# EAGLE design Grove - Sound Sensor v1.6 (EAGLE 6.4)

## Sheet 1 of 2
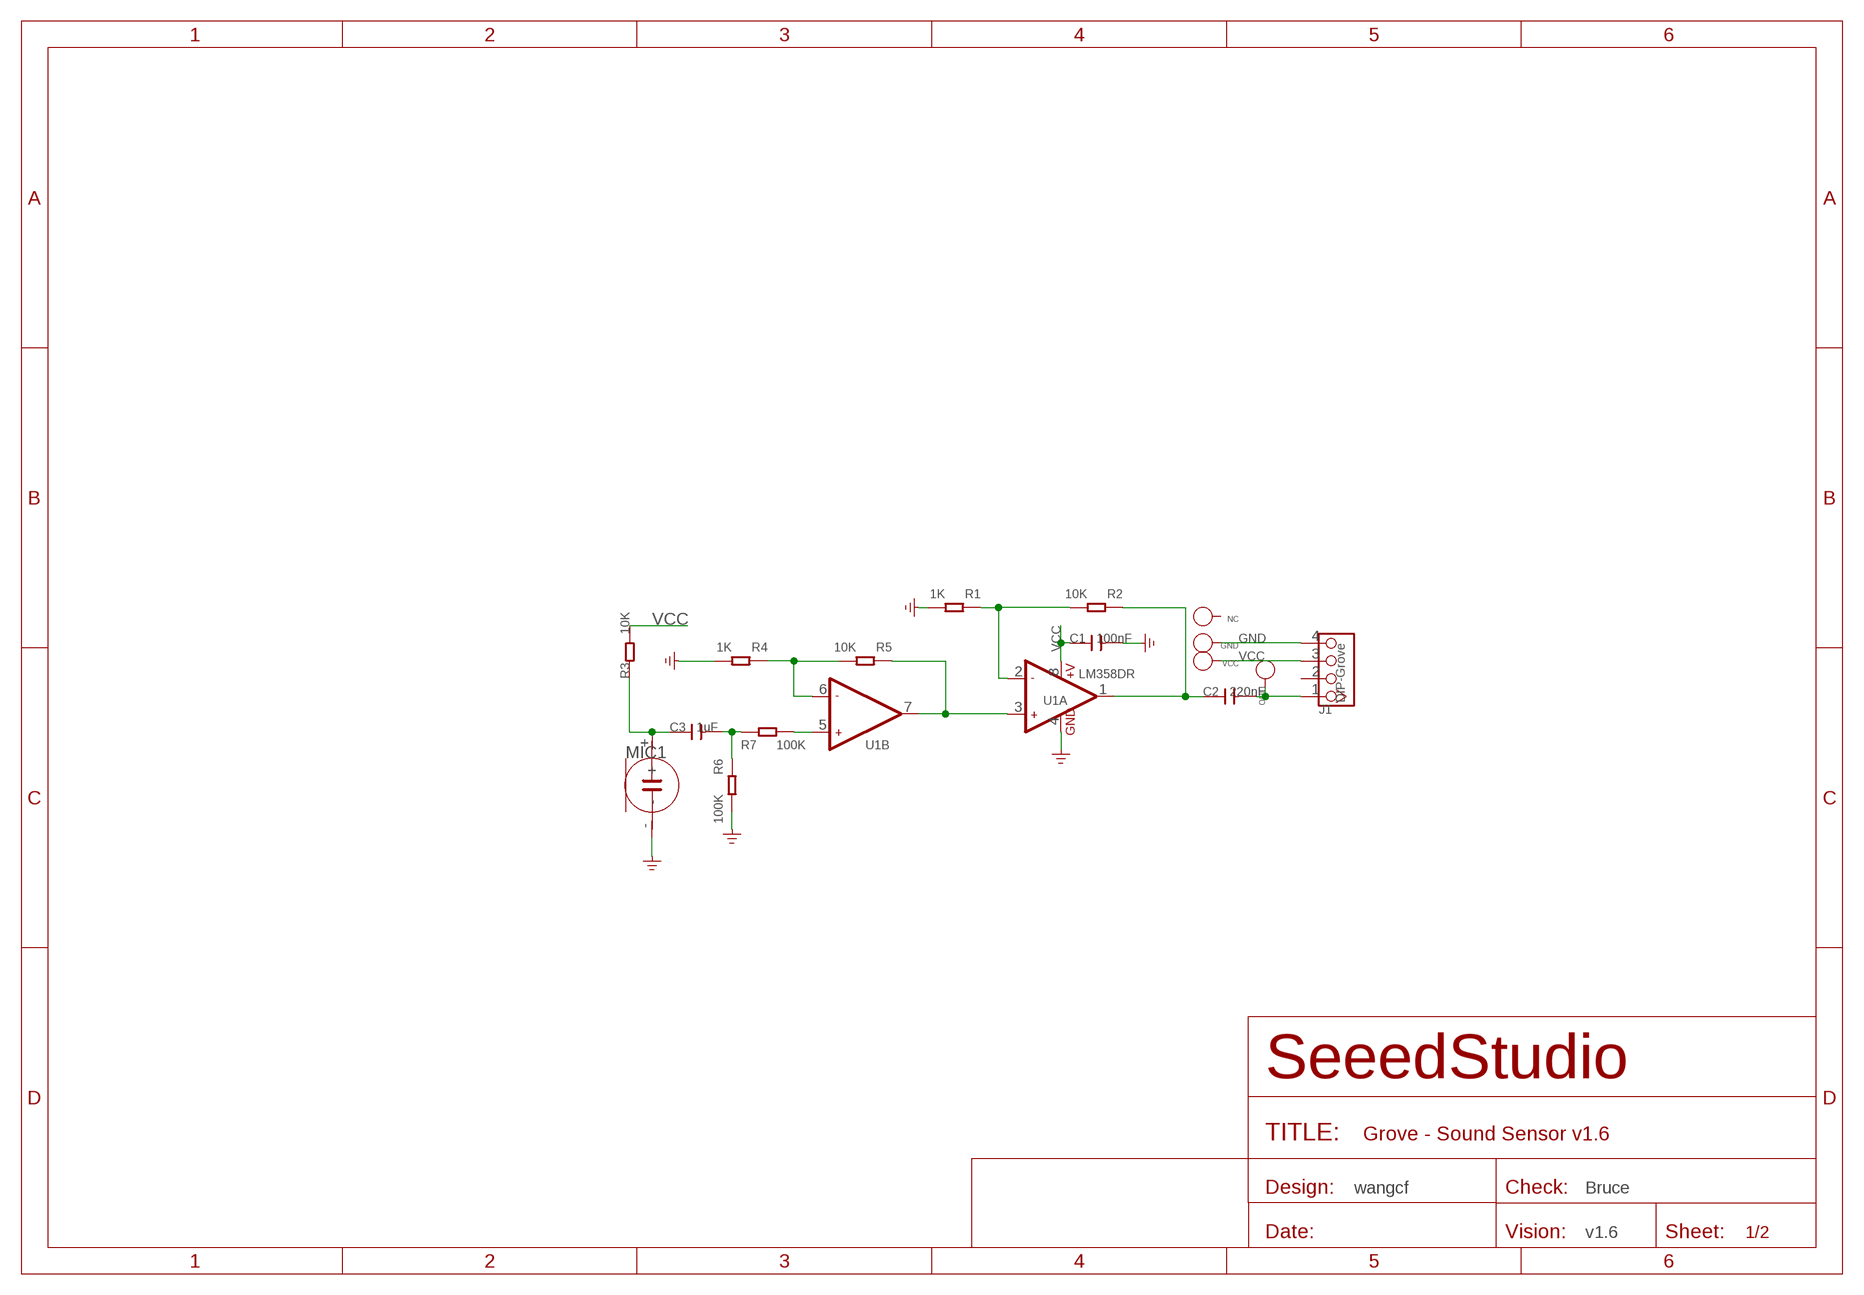
[diagram p0: schematic, sheet 1]

### Parts
C1  100nF  C-0603  [C0603]
C2  220nF  C-0603  [C0603]
C3  1uF  C-0603  [C0603]
GND  PAD-TEST-POINT'4545'  [TP_4545]
J1  DIP-Grove  TWIG-4P-2.0-2.0  [4P-2.0]
MIC1  MICROPHONE'KS-9745P,-56DB'  [2P-D9.7/4.5H]
NC  PAD-TEST-POINT'4545'  [TP_4545]
OUT  PAD-TEST-POINT'4545'  [TP_4545]
R1  1K  R-0603  [R0603]
R2  10K  R-0603  [R0603]
R3  10K  R-0603  [R0603]
R4  1K  R-0603  [R0603]
R5  10K  R-0603  [R0603]
R6  100K  R-0603  [R0603]
R7  100K  R-0603  [R0603]
U1  LM358DR  LMV358D  [SO08]
VCC  PAD-TEST-POINT'4545'  [TP_4545]

### Nets
GND: C1.2 GND.T J1.4 MIC1.- R1.2 R4.2 R6.2 U1.4(A:GND)
N$1: R7.2 U1.5(B:+IN2)
N$2: R4.1 R5.2 U1.6(B:-IN2)
N$3: C3.2 R6.1 R7.1
N$7: C3.1 MIC1.+ R3.1
N$12: R5.1 U1.3(A:+IN1) U1.7(B:OUT2)
N$16: R1.1 R2.2 U1.2(A:-IN1)
OUT: C2.2 J1.1 OUT.T
OUT1: C2.1 R2.1 U1.1(A:OUT1)
VCC: C1.1 J1.3 R3.2 U1.8(A:+V) VCC.T
Unconnected: J1.2 NC.T

### Notes on the sheet
- wangcf | Bruce
- v1.6

## Sheet 2 of 2
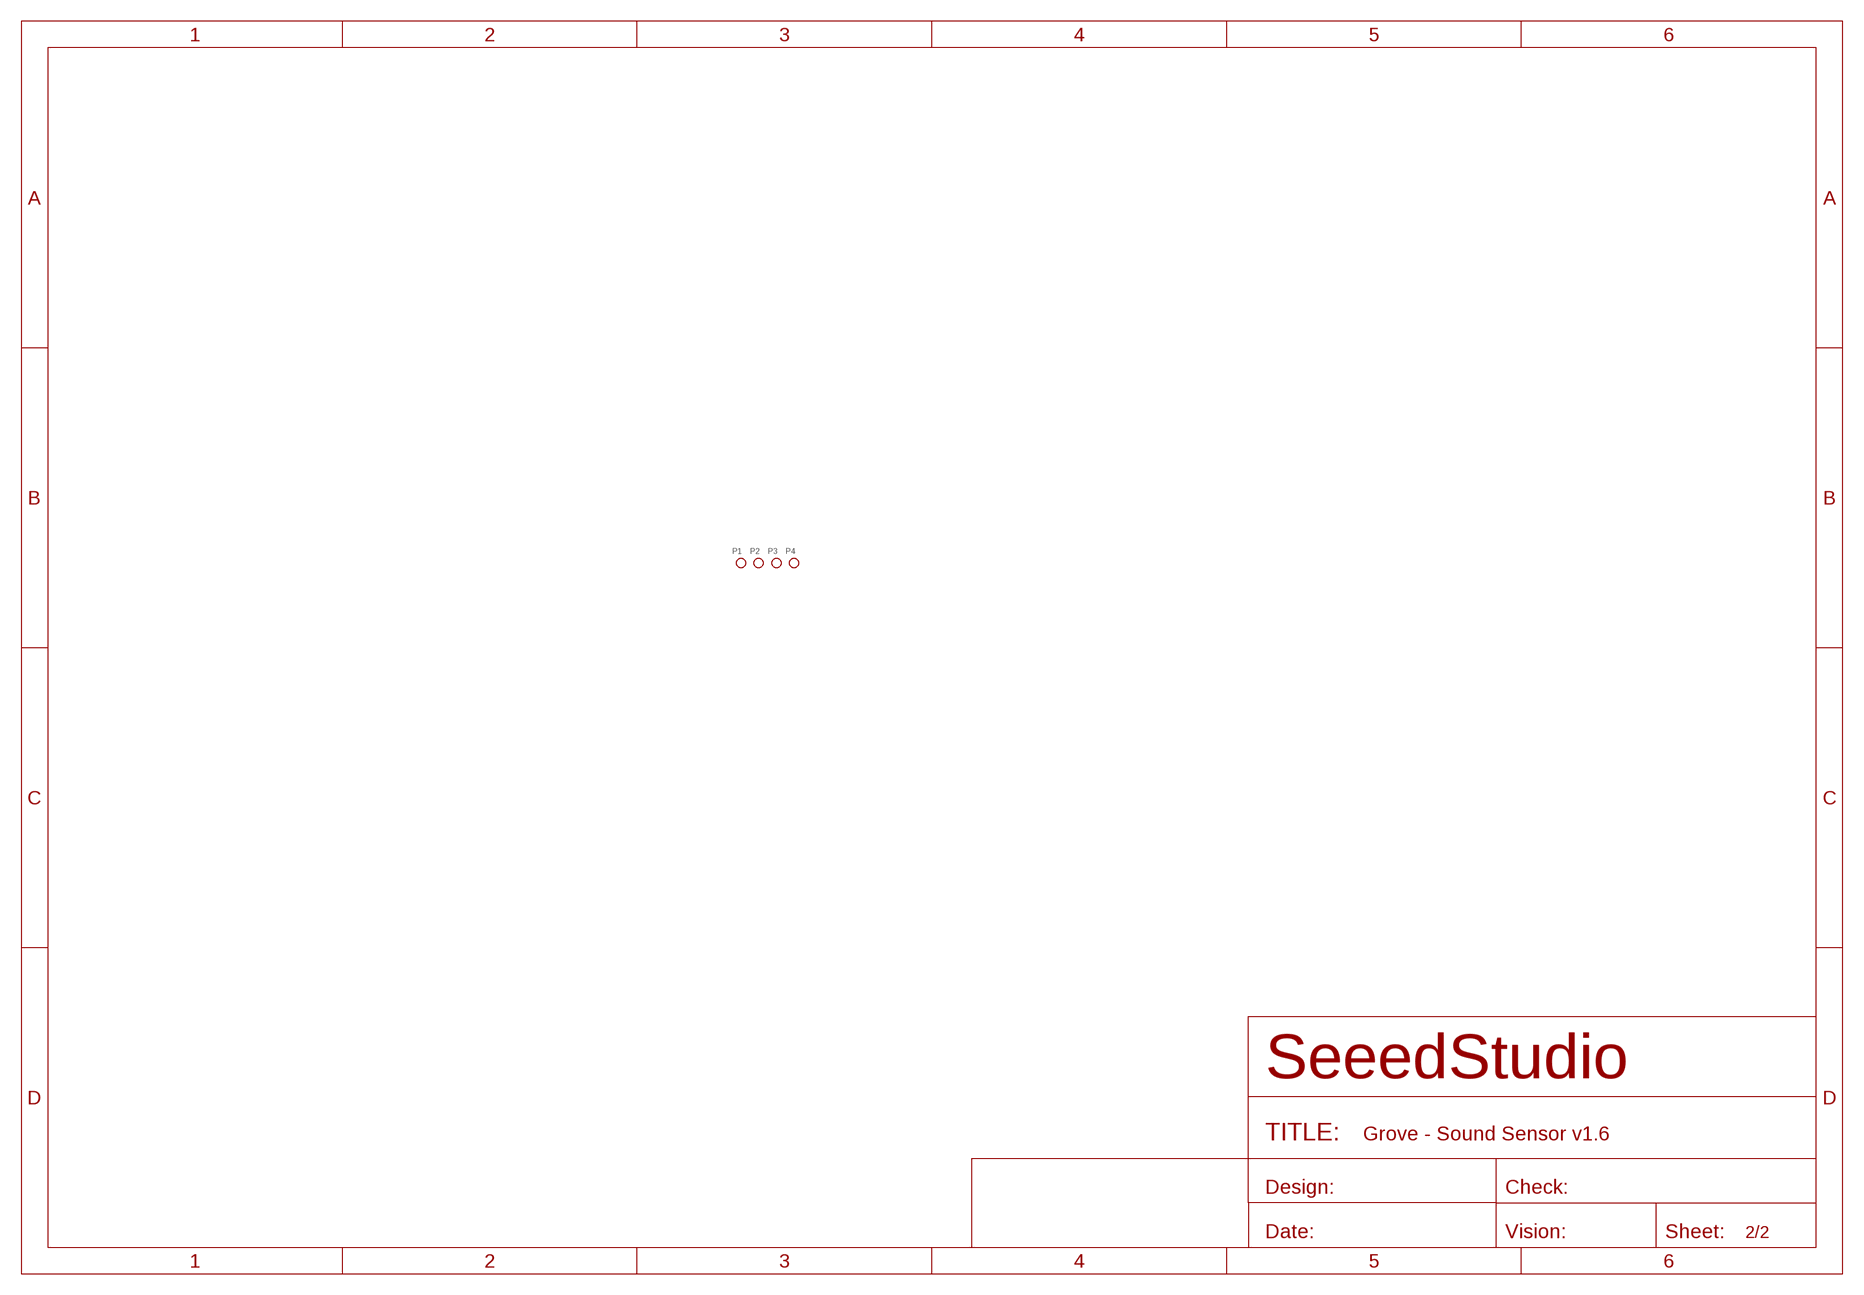
[diagram p1: schematic, sheet 2]

### Parts
P1  PAD-MARK  [ROUND-MARK-1.0]
P2  PAD-MARK  [ROUND-MARK-1.0]
P3  PAD-MARK  [ROUND-MARK-1.0]
P4  PAD-MARK  [ROUND-MARK-1.0]

## Library data of the parts
C1-C3 = Discrete:C*: Ceramic Capacitors
GND NC OUT VCC = Discrete:PAD-TEST-POINT; PARTNO: DNP
J1 = Connector :TWIG-4P-2.0
MIC1 = Discrete:MICROPHONE
P1-P4 = Discrete:PAD-MARK; PARTNO: DNP
R1-R7 = Discrete:R*
U1 = IC:LMV358: General purpose LOW Voltage, Rail-to-Rail Output Amplifiers http://www.fairchildsemi.com/ds/LM/LMV358.pdf

## Net classes
0 default: width 0.152 mm, drill 0.305 mm, clearance 0.152 mm

## Board
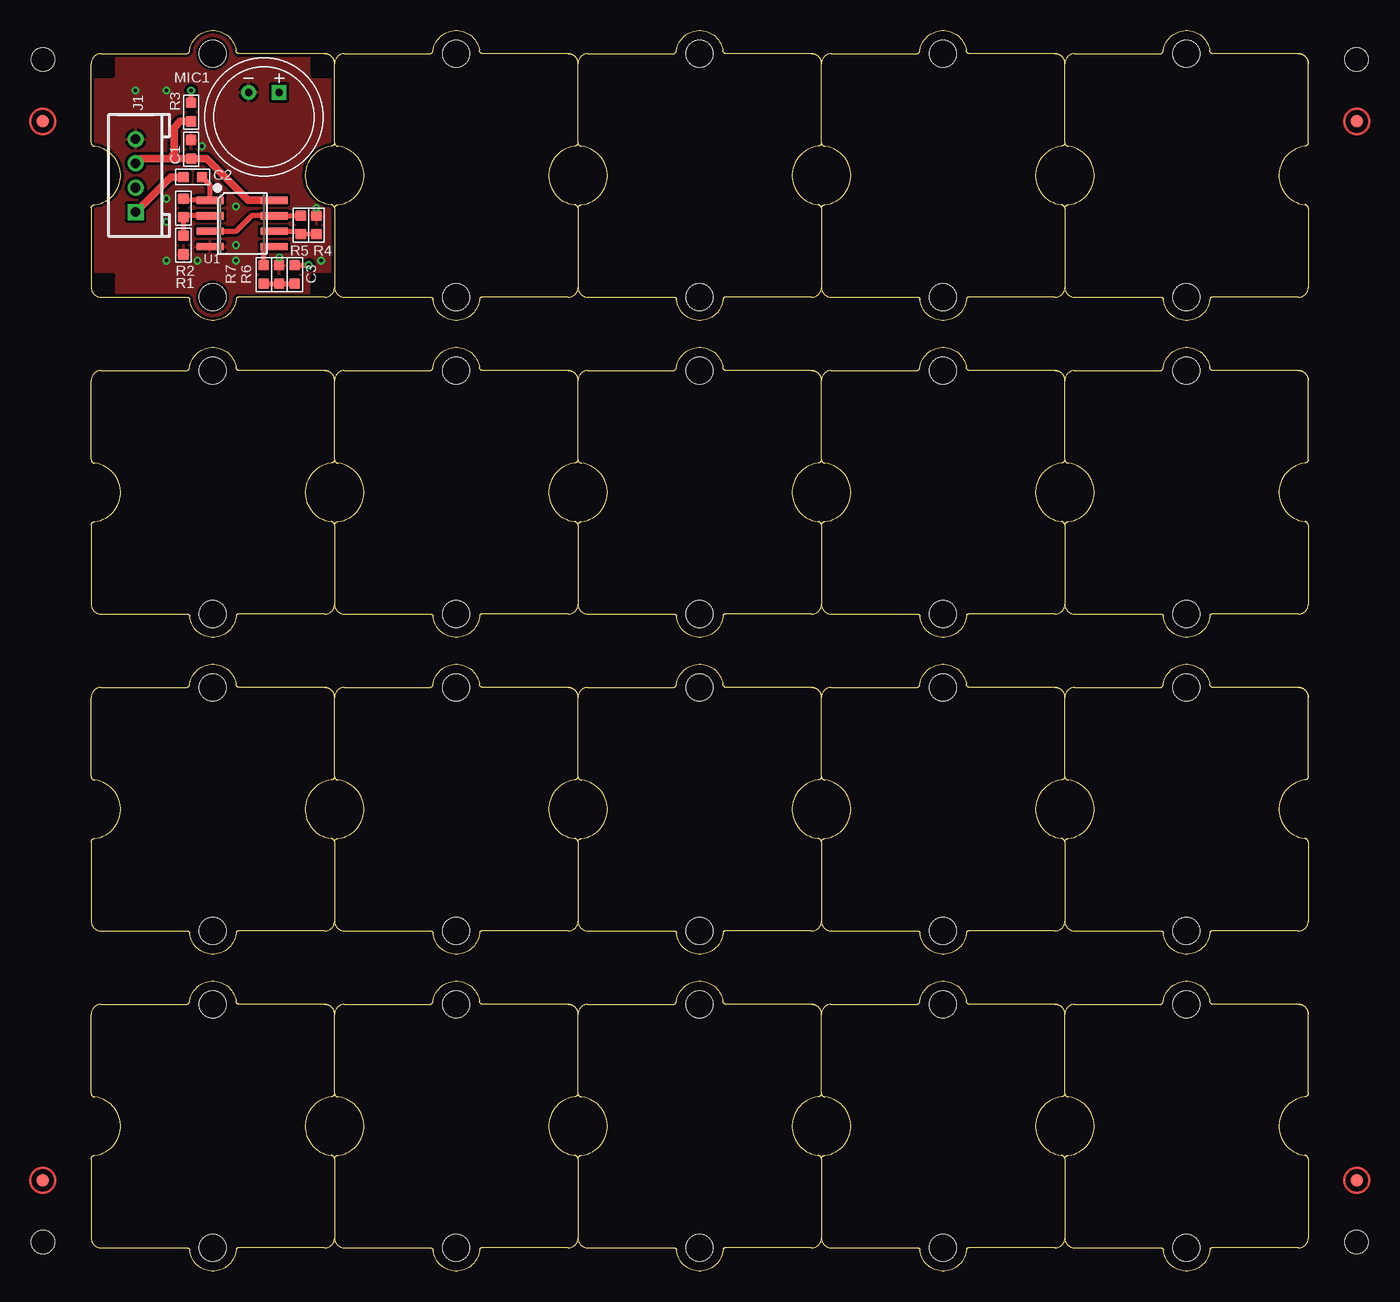
[diagram p2: board, top side]
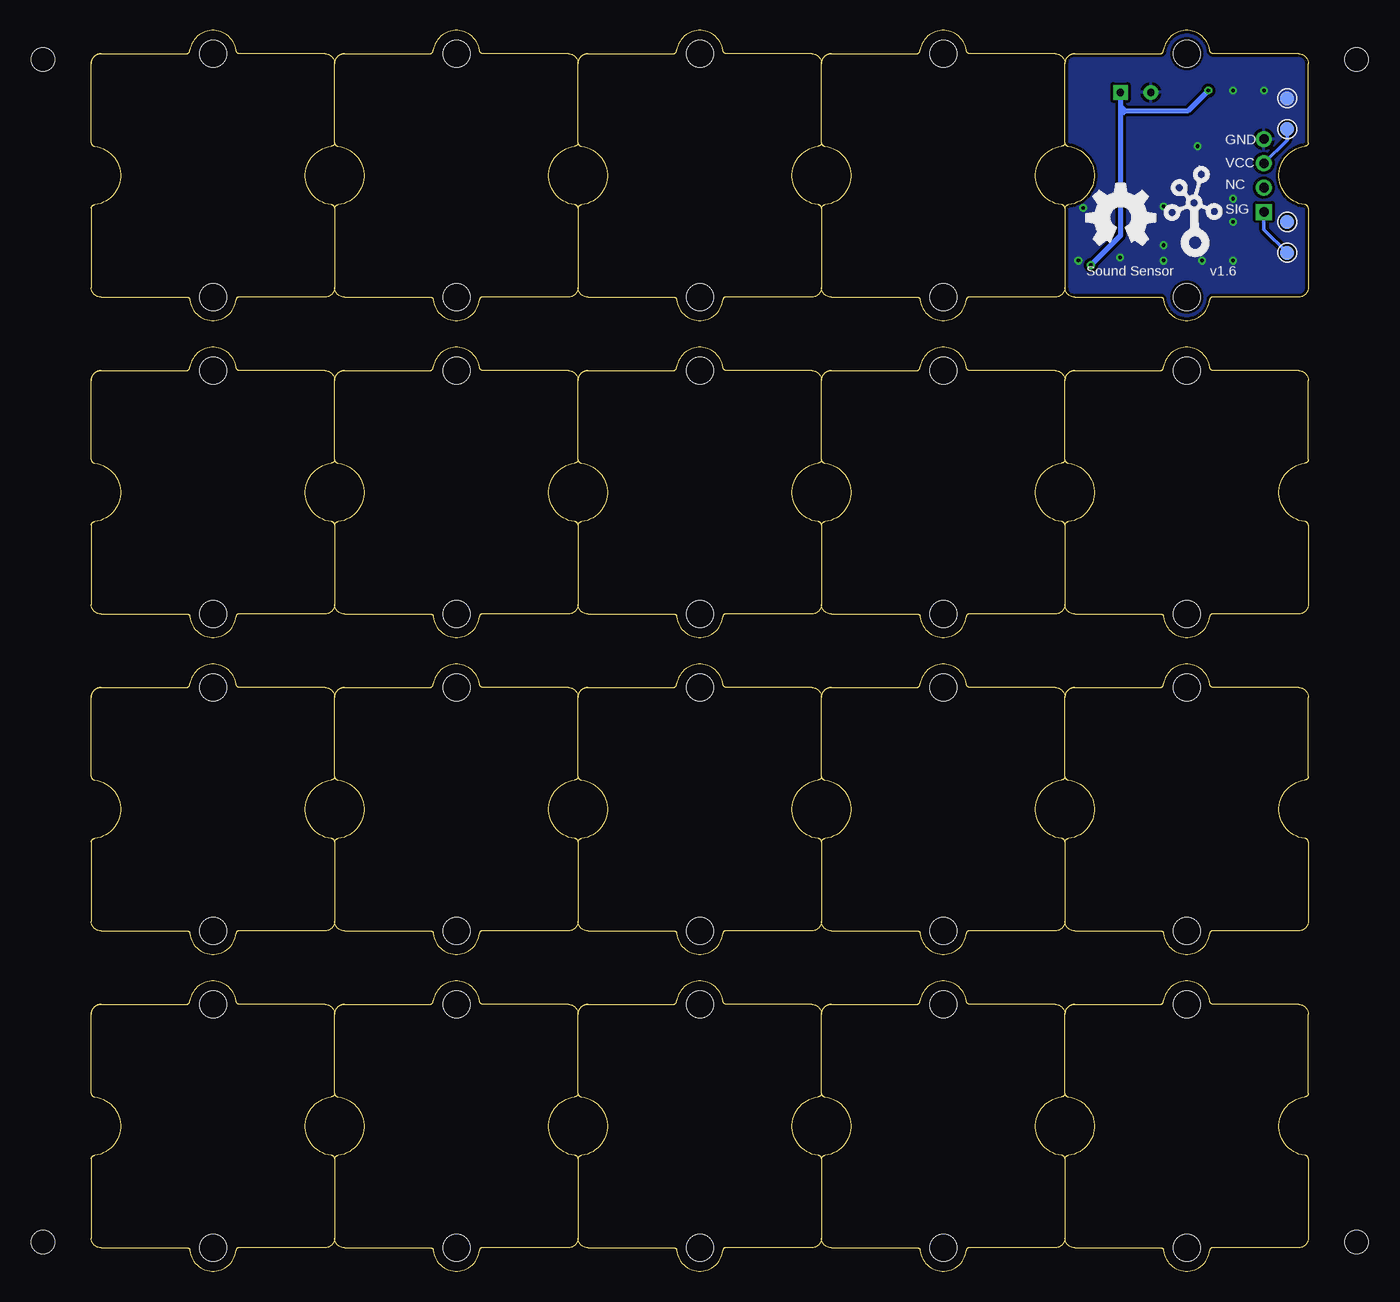
[diagram p3: board, bottom side, seen from below]

Size 100 x 101.93 mm. Coordinates in mm from the lower left corner, seen from the top.
Copper layers (1*16): Top 0.035mm / dielectric 1.5mm / Bottom 0.035mm
Design rules "SeeedStudio_rule_no_angle_090911 *": minimum track width 6mil, minimum drill 12mil, track to track 6mil, track to pad 6mil, pad to pad 6mil, via to via 6mil, smd to smd 0mil, copper to edge 10mil, drill to drill 10mil, minimum pad ring 10mil, minimum via ring 6mil, stop-mask expansion 2mil, vias tented up to drill 100mil, thermal gap 10mil
Holes 1.91 mm at -3.97,2.38 -3.97,99.54 103.98,99.54 103.98,2.38

### Footprints (pad centres in the part's own frame; a part is rotated, then mirrored left to right if it is on the bottom)
C0603 = smd 0.889 x 0.889: 1 -0.762,0; 2 0.762,0
TP_4545 = smd 1.143 x 1.143: T 0,0
4P-2.0 = drill 0.8 pad 1.27 square: 1 -3,0 | drill 0.8 pad 1.27: 2 -1,0; 3 1,0; 4 3,0
2P-D9.7/4.5H = drill 0.6 pad 1.2 square: + 1.25,2 | drill 0.6 pad 1.2: - -1.25,2
ROUND-MARK-1.0 = smd 1.016 x 1.016: P$1 0,0
R0603 = smd 0.889 x 0.889: 1 -0.762,0; 2 0.762,0
SO08 = smd 0.61 x 2.21: 1 -1.905,-2.616; 2 -0.635,-2.616; 3 0.635,-2.616; 4 1.905,-2.616; 5 1.905,2.616; 6 0.635,2.616; 7 -0.635,2.616; 8 -1.905,2.616
1U-DIM-W/-DRILL = hole 2.2: 0,-10; 0,10

### Placement (x,y rotation side)
C1  8.22,92.17 90 top
C2  8.35,89.89 180 top
C3  16.73,81.89 270 top
GND  1.74,96.36 0 bottom
J1  3.65,90.01 90 top
MIC1  14.19,94.84 0 top
NC  1.74,86.2 0 bottom
OUT  1.74,83.66 0 bottom
P1  -3.97,7.46 0 top  (outside the outline)
P2  103.98,7.46 0 top  (outside the outline)
P3  -3.97,94.46 0 top  (outside the outline)
P4  103.98,94.46 0 top  (outside the outline)
R1  7.59,84.3 270 top
R2  7.59,87.35 270 top
R3  8.22,95.22 270 top
R4  18.51,85.95 90 top
R5  17.24,85.95 270 top
R6  15.46,81.89 90 top
R7  14.19,81.89 90 top
U1  12.41,86.08 270 top
U$1  [OSHW_FILLX200_NOTEXT]  18.26,84.3 0 bottom
U$4  [1U-DIM-W/-DRILL]  10,90.01 0 top
U$7  [TWIGLOGO]  9.37,84.3 0 bottom
U$12  [1U-DIM-W/-DRILL]  10,90.01 0 top
U$13  [1U-DIM-W/-DRILL]  30,90.01 0 top
U$14  [1U-DIM-W/-DRILL]  50,90.01 0 top
U$15  [1U-DIM-W/-DRILL]  70,90.01 0 top
U$16  [1U-DIM-W/-DRILL]  90,90.01 0 top
U$17  [1U-DIM-W/-DRILL]  30,63.98 0 top
U$18  [1U-DIM-W/-DRILL]  50,63.98 0 top
U$19  [1U-DIM-W/-DRILL]  70,63.98 0 top
U$20  [1U-DIM-W/-DRILL]  90,63.98 0 top
U$21  [1U-DIM-W/-DRILL]  10,63.98 0 top
U$22  [1U-DIM-W/-DRILL]  30,37.94 0 top
U$23  [1U-DIM-W/-DRILL]  50,37.94 0 top
U$24  [1U-DIM-W/-DRILL]  70,37.94 0 top
U$25  [1U-DIM-W/-DRILL]  90,37.94 0 top
U$26  [1U-DIM-W/-DRILL]  10,37.94 0 top
U$27  [1U-DIM-W/-DRILL]  30,11.91 0 top
U$28  [1U-DIM-W/-DRILL]  50,11.91 0 top
U$29  [1U-DIM-W/-DRILL]  70,11.91 0 top
U$30  [1U-DIM-W/-DRILL]  90,11.91 0 top
U$31  [1U-DIM-W/-DRILL]  10,11.91 0 top
VCC  1.74,93.82 0 bottom

### Tracks (layer width: path | path; a pad name or v marks a point on that pad's centre or on a via)
GND  (via drill 0.3 pad 0.64)
  other vias: 18.51,87.35 6.19,86.2 11.9,84.3 11.9,83.03 6.19,83.03 15.46,83.28 6.19,88.11 6.19,97 3.65,97 8.73,83.03 11.9,87.47 18.89,83.03 9.11,92.43
  pour Top (isolate 0.254): -0.79,102.71 20.8,102.71 20.8,77.31 -0.79,77.31
  pour Bottom (isolate 0.254): -0.79,102.71 20.8,102.71 20.8,77.31 -0.79,77.31
N$1
  Top 0.406: R7.2 14.19,83.92 14.45,84.17 U1.5
N$2
  Top 0.406: U1.6 16.98,85.44 R5.2 R4.1
N$3
  Top 0.406: R7.1 R6.1 C3.2
N$7  (via drill 0.3 pad 0.64)
  Top 0.406: C3.1 v17.87,82.65 | R3.1 v8.22,97
  Bottom 0.406: MIC1.+ 15.44,95.35 | 15.44,95.35 15.44,85.08 v17.87,82.65 | 15.08,95.35 15.44,95.35 | 15.08,95.35 15.33,95.6 | 15.08,95.35 15.33,95.09 | 15.08,95.35 9.87,95.35 v8.22,97
N$12
  Top 0.406: R5.1 U1.7 13.18,86.71 11.9,85.44 U1.3
N$16
  Top 0.406: U1.2 7.71,86.71 R2.2 R1.1
OUT
  Top 0.61: C2.2 6.52,89.89 J1.1
  Bottom 0.305: J1.1 3.65,85.57 OUT.T
OUT1
  Top 0.406: 7.59,87.85 R2.1 7.71,87.98 U1.1 9.8,89.2 C2.1
VCC
  Top 0.61: 7.21,91.41 8.1,91.41 C1.1 9.49,91.41 12.92,87.98 U1.8 | 7.21,91.41 6.83,91.41 | 6.83,91.41 6.44,91.41 | 6.44,91.41 4.05,91.41 J1.3 | R3.2 7.33,94.46 6.83,93.95 6.83,91.79 | 6.83,91.79 6.83,91.41 | 6.83,91.79 6.44,91.41 | 6.83,91.79 7.21,91.41
  Bottom 0.305: VCC.T 1.74,92.92 J1.3

### Text on the board
bPlace: GND | VCC | NC | SIG | v1.6 | Sound Sensor